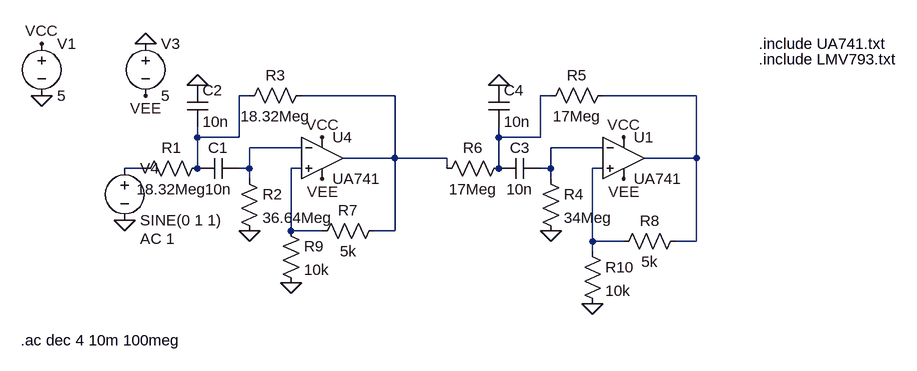
[diagram p0: schematic 5thOrderButterworth.asc]
5thOrderButterworth.asc, the LTspice schematic file:
Version 4
SHEET 1 884 680
WIRE -144 -96 -160 -96
WIRE 80 -96 -64 -96
WIRE 320 -96 304 -96
WIRE 544 -96 400 -96
WIRE -224 -32 -224 -48
WIRE -160 -32 -160 -96
WIRE -160 -32 -224 -32
WIRE 240 -32 240 -48
WIRE 304 -32 304 -96
WIRE 304 -32 240 -32
WIRE -64 -16 -144 -16
WIRE 400 -16 320 -16
WIRE 80 0 80 -96
WIRE 80 0 0 0
WIRE 160 0 80 0
WIRE 544 0 544 -96
WIRE 544 0 464 0
WIRE -304 16 -336 16
WIRE -224 16 -224 -32
WIRE -144 16 -144 -16
WIRE -144 16 -160 16
WIRE -64 16 -80 16
WIRE 160 16 160 0
WIRE 240 16 240 -32
WIRE 320 16 320 -16
WIRE 320 16 304 16
WIRE 400 16 384 16
WIRE -144 32 -144 16
WIRE 320 32 320 16
WIRE -80 112 -80 16
WIRE -32 112 -80 112
WIRE 80 112 80 0
WIRE 80 112 48 112
WIRE 384 128 384 16
WIRE 432 128 384 128
WIRE 544 128 544 0
WIRE 544 128 512 128
WIRE 384 144 384 128
FLAG -464 -176 VCC
FLAG -304 -96 VEE
FLAG -464 -96 0
FLAG -304 -176 0
FLAG -336 96 0
FLAG -224 -112 0
FLAG -144 112 0
FLAG 240 -112 0
FLAG 320 112 0
FLAG -32 -32 VCC
FLAG 432 -32 VCC
FLAG -32 32 VEE
FLAG 432 32 VEE
FLAG -80 192 0
FLAG 384 224 0
SYMBOL voltage -464 -192 R0
WINDOW 123 0 0 Left 0
WINDOW 39 0 0 Left 0
SYMATTR InstName V1
SYMATTR Value 5
SYMBOL voltage -304 -192 R0
WINDOW 123 0 0 Left 0
WINDOW 39 0 0 Left 0
SYMATTR InstName V3
SYMATTR Value 5
SYMBOL voltage -336 0 R0
WINDOW 123 24 124 Left 2
WINDOW 39 0 0 Left 0
SYMATTR Value2 AC 1
SYMATTR InstName V4
SYMATTR Value SINE(0 1 1)
SYMBOL Opamps\\opamp2 -32 -64 R0
SYMATTR InstName U4
SYMATTR Value UA741
SYMBOL res -208 0 R90
WINDOW 0 0 56 VBottom 2
WINDOW 3 32 56 VTop 2
SYMATTR InstName R1
SYMATTR Value 18.32Meg
SYMBOL cap -160 0 R90
WINDOW 0 0 32 VBottom 2
WINDOW 3 32 32 VTop 2
SYMATTR InstName C1
SYMATTR Value 10n
SYMBOL res -160 16 R0
SYMATTR InstName R2
SYMATTR Value 36.64Meg
SYMBOL cap -240 -112 R0
SYMATTR InstName C2
SYMATTR Value 10n
SYMBOL res -48 -112 R90
WINDOW 0 0 56 VBottom 2
WINDOW 3 32 56 VTop 2
SYMATTR InstName R3
SYMATTR Value 18.32Meg
SYMBOL Opamps\\opamp2 432 -64 R0
SYMATTR InstName U1
SYMATTR Value UA741
SYMBOL cap 304 0 R90
WINDOW 0 0 32 VBottom 2
WINDOW 3 32 32 VTop 2
SYMATTR InstName C3
SYMATTR Value 10n
SYMBOL res 304 16 R0
SYMATTR InstName R4
SYMATTR Value 34Meg
SYMBOL cap 224 -112 R0
SYMATTR InstName C4
SYMATTR Value 10n
SYMBOL res 416 -112 R90
WINDOW 0 0 56 VBottom 2
WINDOW 3 32 56 VTop 2
SYMATTR InstName R5
SYMATTR Value 17Meg
SYMBOL res 256 0 R90
WINDOW 0 0 56 VBottom 2
WINDOW 3 32 56 VTop 2
SYMATTR InstName R6
SYMATTR Value 17Meg
SYMBOL res 64 96 R90
WINDOW 0 0 56 VBottom 2
WINDOW 3 32 56 VTop 2
SYMATTR InstName R7
SYMATTR Value 5k
SYMBOL res 528 112 R90
WINDOW 0 0 56 VBottom 2
WINDOW 3 32 56 VTop 2
SYMATTR InstName R8
SYMATTR Value 5k
SYMBOL res -96 96 R0
SYMATTR InstName R9
SYMATTR Value 10k
SYMBOL res 368 128 R0
SYMATTR InstName R10
SYMATTR Value 10k
TEXT 640 -176 Left 2 !.include UA741.txt
TEXT 640 -152 Left 2 !.include LMV793.txt
TEXT -496 280 Left 2 !.ac dec 4 10m 100meg

The netlist it stands for:
* 5thOrderButterworth.asc
V1 VCC 0 5
V3 0 VEE 5
V4 N007 0 SINE(0 1 1) AC 1
XU4 N008 N005 VCC VEE N002 UA741  ; pins In+ In- V+ V- OUT
R1 N001 N007 18.32Meg
C1 N005 N001 10n
R2 N005 0 36.64Meg
C2 0 N001 10n
R3 N002 N001 18.32Meg
XU1 N009 N006 VCC VEE N004 UA741  ; pins In+ In- V+ V- OUT
C3 N006 N003 10n
R4 N006 0 34Meg
C4 0 N003 10n
R5 N004 N003 17Meg
R6 N003 N002 17Meg
R7 N002 N008 5k
R8 N004 N009 5k
R9 N008 0 10k
R10 N009 0 10k
.include UA741.txt
.include LMV793.txt
.ac dec 4 10m 100meg
.backanno
.end